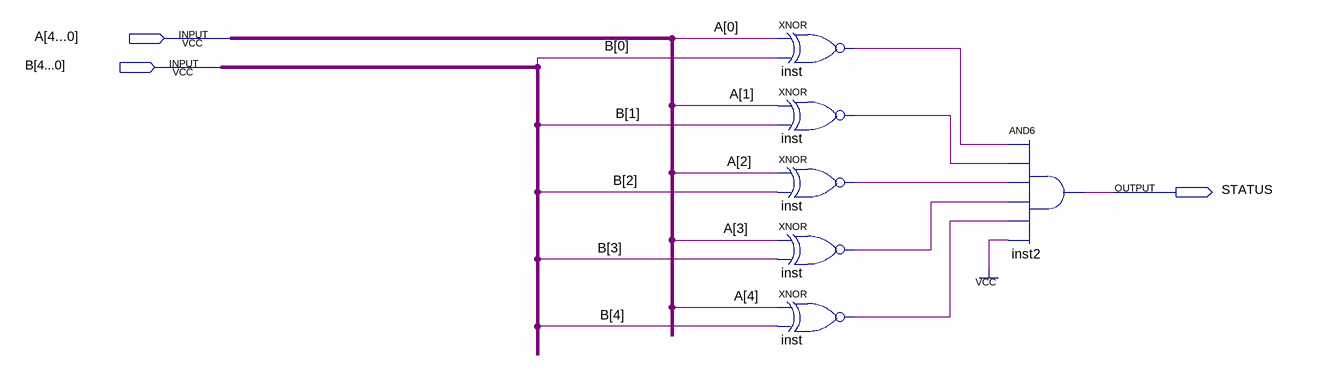
[diagram p0: schematic sheet]
// Quartus schematic AigualB.bdf as structural Verilog: 6 symbols, 3 pins
module AigualB (
  input  \A[4...0] ,
  input  \B[4...0] ,
  output STATUS
);

  wire inst_out, inst_out_2, inst_out_3, inst_out_4, inst_out_5;
  wire [4:0] A, B;

  xnor inst (inst_out_2, A[0], B[0]);
  xnor inst_dup2 (inst_out, A[1], B[1]);
  xnor inst_dup3 (inst_out_4, A[2], B[2]);
  xnor inst_dup4 (inst_out_3, A[3], B[3]);
  xnor inst_dup5 (inst_out_5, A[4], B[4]);
  and inst2 (STATUS, inst_out_2, inst_out, inst_out_4, inst_out_3, inst_out_5, 1'b1);
endmodule
